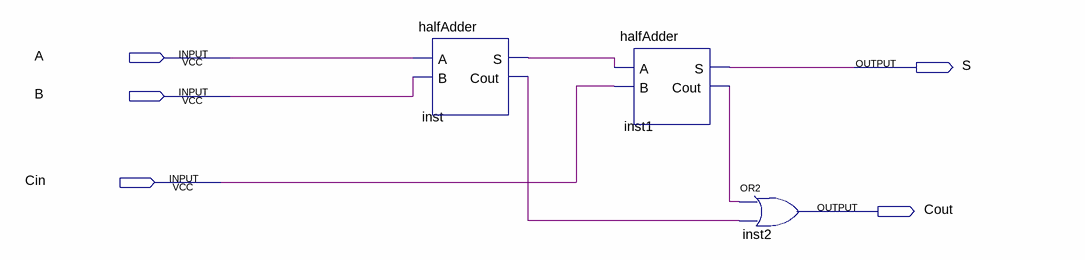
[diagram p0: schematic sheet]
// Quartus schematic FullAdder.bdf as structural Verilog: 3 symbols, 5 pins
module FullAdder (
  input  A,
  input  B,
  input  Cin,
  output S,
  output Cout
);

  wire inst1_cout, inst_cout, inst_s;

  halfAdder inst (.A(A), .B(B), .S(inst_s), .Cout(inst_cout));
  halfAdder inst1 (.A(inst_s), .B(Cin), .S(S), .Cout(inst1_cout));
  or inst2 (Cout, inst1_cout, inst_cout);
endmodule
